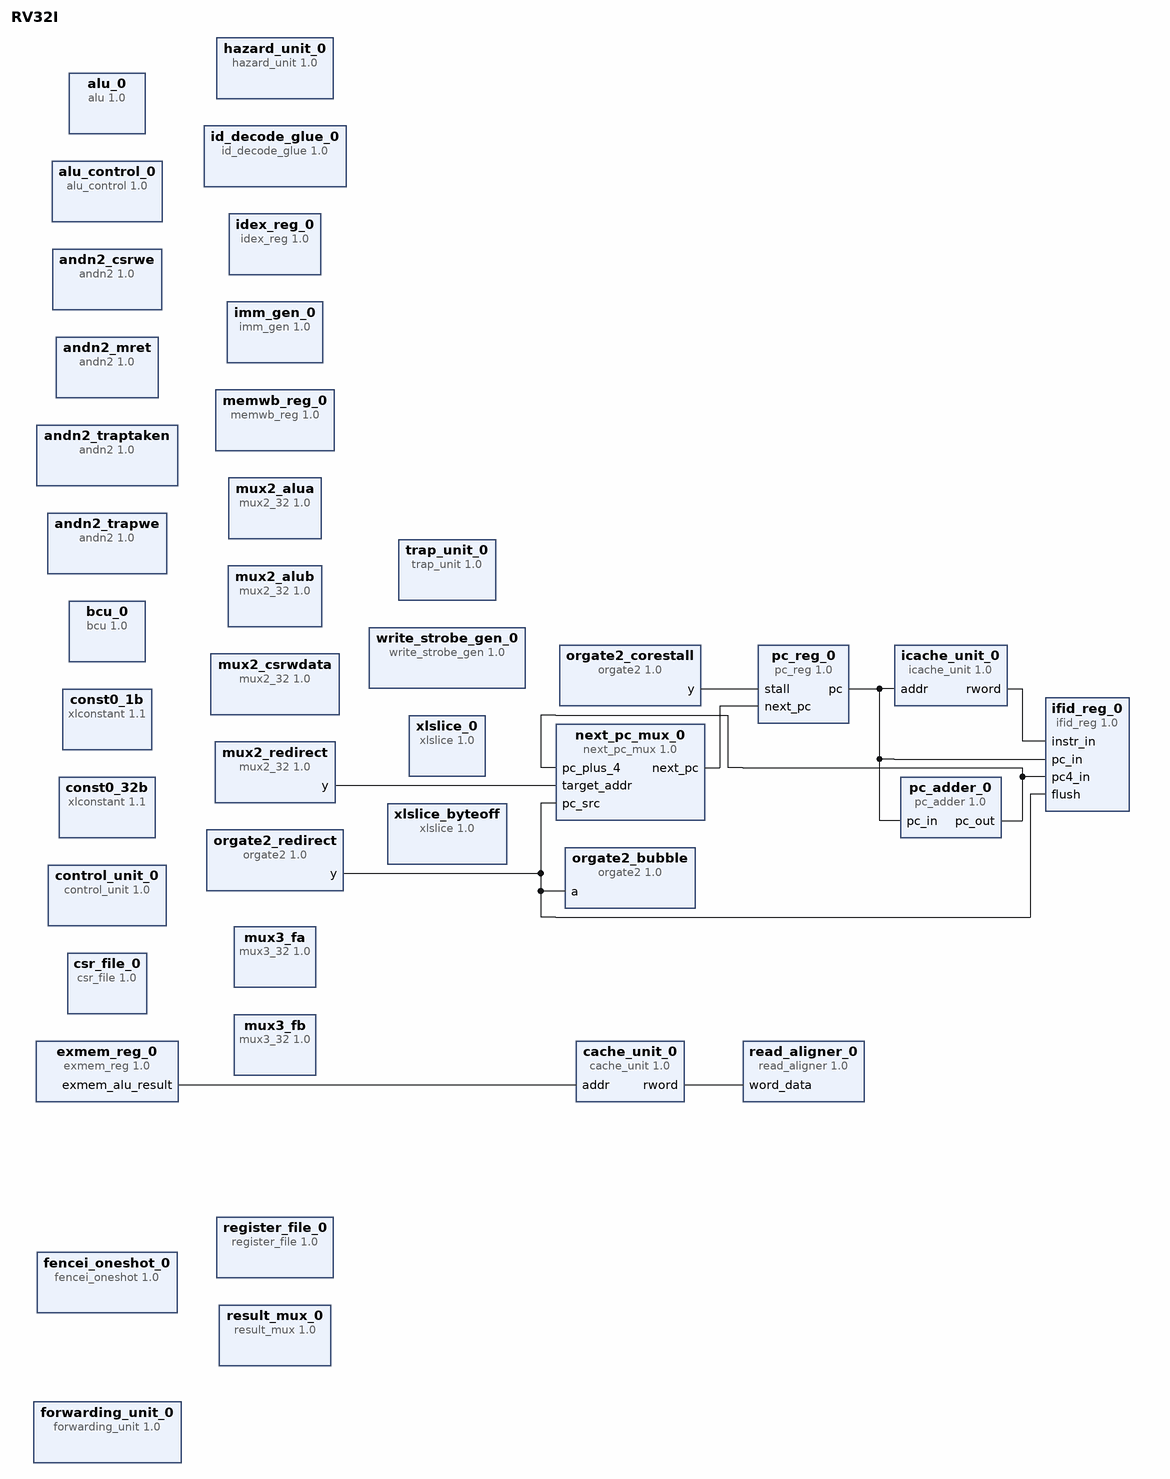
[diagram p0: block diagram of the top level]
# Vivado block design RV32I, xc7z020clg400-1, Vivado 2025.2
create_bd_design RV32I

create_bd_cell -type ip -vlnv user:rv32:orgate2:1.0 orgate2_redirect
create_bd_cell -type ip -vlnv user:rv32:pc_reg:1.0 pc_reg_0
create_bd_cell -type ip -vlnv user:rv32:pc_adder:1.0 pc_adder_0
create_bd_cell -type ip -vlnv user:rv32:next_pc_mux:1.0 next_pc_mux_0
create_bd_cell -type ip -vlnv user:rv32:mux2_32:1.0 mux2_redirect
create_bd_cell -type ip -vlnv user:rv32:orgate2:1.0 orgate2_corestall
create_bd_cell -type ip -vlnv user:rv32:ifid_reg:1.0 ifid_reg_0
create_bd_cell -type ip -vlnv user:rv32:orgate2:1.0 orgate2_bubble
create_bd_cell -type ip -vlnv user:rv32:control_unit:1.0 control_unit_0
create_bd_cell -type ip -vlnv user:rv32:imm_gen:1.0 imm_gen_0
create_bd_cell -type ip -vlnv user:rv32:register_file:1.0 register_file_0
create_bd_cell -type ip -vlnv user:rv32:hazard_unit:1.0 hazard_unit_0
create_bd_cell -type ip -vlnv user:rv32:id_decode_glue:1.0 id_decode_glue_0
create_bd_cell -type ip -vlnv user:rv32:mux2_32:1.0 mux2_csrwdata
create_bd_cell -type ip -vlnv user:rv32:idex_reg:1.0 idex_reg_0
create_bd_cell -type ip -vlnv user:rv32:icache_unit:1.0 icache_unit_0
create_bd_cell -type ip -vlnv user:rv32:cache_unit:1.0 cache_unit_0
create_bd_cell -type ip -vlnv user:rv32:forwarding_unit:1.0 forwarding_unit_0
create_bd_cell -type ip -vlnv user:rv32:mux3_32:1.0 mux3_fa
create_bd_cell -type ip -vlnv user:rv32:mux3_32:1.0 mux3_fb
create_bd_cell -type ip -vlnv user:rv32:mux2_32:1.0 mux2_alua
create_bd_cell -type ip -vlnv user:rv32:mux2_32:1.0 mux2_alub
create_bd_cell -type ip -vlnv user:rv32:alu_control:1.0 alu_control_0
create_bd_cell -type ip -vlnv user:rv32:alu:1.0 alu_0
create_bd_cell -type ip -vlnv user:rv32:bcu:1.0 bcu_0
create_bd_cell -type ip -vlnv user:rv32:csr_file:1.0 csr_file_0
create_bd_cell -type ip -vlnv user:rv32:trap_unit:1.0 trap_unit_0
create_bd_cell -type ip -vlnv user:rv32:andn2:1.0 andn2_csrwe
create_bd_cell -type ip -vlnv user:rv32:andn2:1.0 andn2_mret
create_bd_cell -type ip -vlnv user:rv32:andn2:1.0 andn2_trapwe
create_bd_cell -type ip -vlnv user:rv32:andn2:1.0 andn2_traptaken
create_bd_cell -type ip -vlnv user:rv32:fencei_oneshot:1.0 fencei_oneshot_0
create_bd_cell -type ip -vlnv user:rv32:exmem_reg:1.0 exmem_reg_0
create_bd_cell -type ip -vlnv user:rv32:read_aligner:1.0 read_aligner_0
create_bd_cell -type ip -vlnv user:rv32:write_strobe_gen:1.0 write_strobe_gen_0
create_bd_cell -type ip -vlnv xilinx.com:ip:xlslice:1.0 xlslice_0
create_bd_cell -type ip -vlnv user:rv32:memwb_reg:1.0 memwb_reg_0
create_bd_cell -type ip -vlnv user:rv32:result_mux:1.0 result_mux_0
create_bd_cell -type ip -vlnv xilinx.com:ip:xlconstant:1.1 const0_1b
set_property -dict {CONFIG.CONST_VAL 0} [get_bd_cells const0_1b]
create_bd_cell -type ip -vlnv xilinx.com:ip:xlconstant:1.1 const0_32b
set_property -dict {CONFIG.CONST_VAL 0 CONFIG.CONST_WIDTH 32} [get_bd_cells const0_32b]
create_bd_cell -type ip -vlnv xilinx.com:ip:xlslice:1.0 xlslice_byteoff

# ---- connections ----

connect_bd_net [get_bd_pins cache_unit_0/rword] [get_bd_pins read_aligner_0/word_data]
connect_bd_net [get_bd_pins exmem_reg_0/exmem_alu_result] [get_bd_pins cache_unit_0/addr]
connect_bd_net [get_bd_pins icache_unit_0/rword] [get_bd_pins ifid_reg_0/instr_in]
connect_bd_net [get_bd_pins mux2_redirect/y] [get_bd_pins next_pc_mux_0/target_addr]
connect_bd_net [get_bd_pins next_pc_mux_0/next_pc] [get_bd_pins pc_reg_0/next_pc]
connect_bd_net [get_bd_pins orgate2_corestall/y] [get_bd_pins pc_reg_0/stall]
connect_bd_net [get_bd_pins orgate2_redirect/y] [get_bd_pins next_pc_mux_0/pc_src] [get_bd_pins ifid_reg_0/flush] [get_bd_pins orgate2_bubble/a]
connect_bd_net [get_bd_pins pc_adder_0/pc_out] [get_bd_pins next_pc_mux_0/pc_plus_4] [get_bd_pins ifid_reg_0/pc4_in]
connect_bd_net [get_bd_pins pc_reg_0/pc] [get_bd_pins pc_adder_0/pc_in] [get_bd_pins ifid_reg_0/pc_in] [get_bd_pins icache_unit_0/addr]

validate_bd_design
save_bd_design
